# EAGLE schematic front_module_3 (EAGLE 6.4)
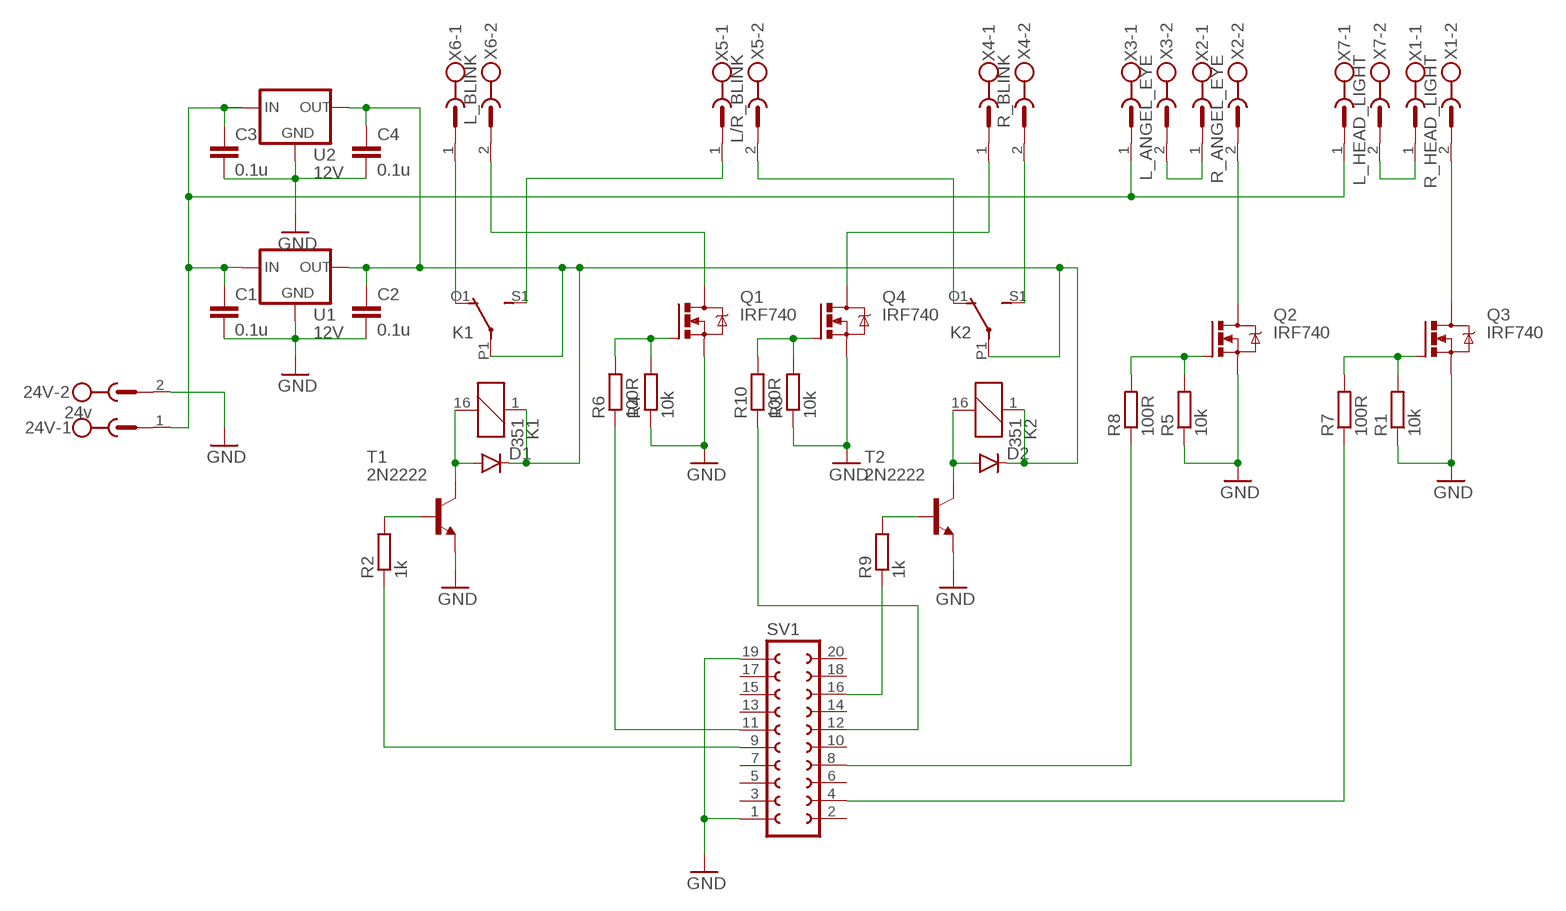
[diagram p0: schematic, sheet 1]

## Parts
24V  24v  MSTBV2  [MSTBV2]
C1  0.1u  0.1UF-50V-20%(PTH)KIT-EZ  [CAP-PTH-SMALL-KIT]
C2  0.1u  0.1UF-50V-20%(PTH)KIT-EZ  [CAP-PTH-SMALL-KIT]
C3  0.1u  0.1UF-50V-20%(PTH)KIT-EZ  [CAP-PTH-SMALL-KIT]
C4  0.1u  0.1UF-50V-20%(PTH)KIT-EZ  [CAP-PTH-SMALL-KIT]
D1  DIODEKIT2  [DIODE-1N4001-KIT]
D2  DIODEKIT2  [DIODE-1N4001-KIT]
K1  351  [351]
K2  351  [351]
Q1  IRF740  [TO220BV]
Q2  IRF740  [TO220BV]
Q3  IRF740  [TO220BV]
Q4  IRF740  [TO220BV]
R1  10k  R-EU_0207/10  [0207/10]
R2  1k  R-EU_0207/10  [0207/10]
R3  10k  R-EU_0207/10  [0207/10]
R4  10k  R-EU_0207/10  [0207/10]
R5  10k  R-EU_0207/10  [0207/10]
R6  100R  R-EU_0207/10  [0207/10]
R7  100R  R-EU_0207/10  [0207/10]
R8  100R  R-EU_0207/10  [0207/10]
R9  1k  R-EU_0207/10  [0207/10]
R10  100R  R-EU_0207/10  [0207/10]
SV1  FE10-2W  [FE10-2W]
T1  2N2222  [TO92-EBC-OVAL]
T2  2N2222  [TO92-EBC-OVAL]
U1  12V  V_REG_78XXSINK  [TO220-IGO]
U2  12V  V_REG_78XXSINK  [TO220-IGO]
X1  R_HEAD_LIGHT  MSTBV2  [MSTBV2]
X2  R_ANGEL_EYE  MSTBV2  [MSTBV2]
X3  L_ANGEL_EYE  MSTBV2  [MSTBV2]
X4  R_BLINK  MSTBV2  [MSTBV2]
X5  L/R_BLINK  MSTBV2  [MSTBV2]
X6  L_BLINK  MSTBV2  [MSTBV2]
X7  L_HEAD_LIGHT  MSTBV2  [MSTBV2]

## Nets
GND: 24V.2 C1.2 C2.2 C3.2 C4.2 Q1.S Q2.S Q3.S Q4.S R1.1 R3.1 R4.1 R5.1 SV1.1 SV1.19 T1.E T2.E U1.GND U2.GND
N$1: R2.2 T1.B
N$2: 24V.1 C1.1 C3.1 U1.IN U2.IN X3.1 X7.1
N$3: Q1.D X6.2
N$4: Q1.G R4.2 R6.2
N$5: K1.O1(2:O) X6.1
N$6: K1.S1(2:S) X5.1
N$7: K2.O1(2:O) X5.2
N$8: K2.S1(2:S) X4.2
N$9: X2.1 X3.2
N$10: X1.1 X7.2
N$11: Q2.D X2.2
N$12: Q3.D X1.2
N$13: Q2.G R5.2 R8.2
N$14: Q3.G R1.2 R7.2
N$15: D1.A K1.16 T1.C
N$16: R9.2 T2.B
N$17: D2.A K2.16 T2.C
N$18: C2.1 C4.1 D1.C D2.C K1.1 K1.P1(2:P) K2.1 K2.P1(2:P) U1.OUT U2.OUT
N$19: R7.1 SV1.4
N$20: R8.1 SV1.8
N$21: R9.1 SV1.16
N$22: R6.1 SV1.11
N$23: R2.1 SV1.9
N$24: R10.1 SV1.12
N$25: Q4.D X4.1
N$26: Q4.G R3.2 R10.2
Unconnected: K1.O2(3:O) K1.P2(3:P) K1.S2(3:S) K2.O2(3:O) K2.P2(3:P) K2.S2(3:S) SV1.2 SV1.3 SV1.5 SV1.6 SV1.7 SV1.10 SV1.13 SV1.14 SV1.15 SV1.17 SV1.18 SV1.20

## Library data of the parts
24V X1-X7 = con-phoenix-500:MSTBV2: PHOENIX; OC_FARNELL: unknown; OC_NEWARK: unknown
C1-C4 = SparkFun-Capacitors:0.1UF-50V-20%(PTH): CAP-08370; PROD_ID: CAP-08370
D1 D2 = SparkFun-DiscreteSemi:DIODE: Diode These are standard reverse protection diodes and small signal diodes. SMA package can handle up to about 1A. SOD-323 can handle about 200mA. What the SOD-323 package when ordering, there are some mfgs out there that are 5-pin packages.
K1 K2 = relay:351: RELAY 2 x switch, Omron; OC_FARNELL: unknown; OC_NEWARK: unknown
Q1-Q4 = transistor-power:IRF740: N-CHANNEL MOS FET
R1-R10 = resistor:R-EU_: RESISTOR, European symbol
SV1 = con-lsta:FE10-2W: FEMALE HEADER; OC_FARNELL: unknown; OC_NEWARK: unknown
T1 T2 = adafruit:2N2222: NPN TRANSISTOR Big oval pads
U1 U2 = SparkFun-PowerIC:V_REG_78XX: Voltage Regulator Standard 78xx regulator. IGO (Input Ground Output). Spark Fun Electronics SKU : COM-00107